# Altium schematic sheet clock_led_switches.SchDoc: Power Switches
size 290 x 209 mm; Author: chs; Revision: 1
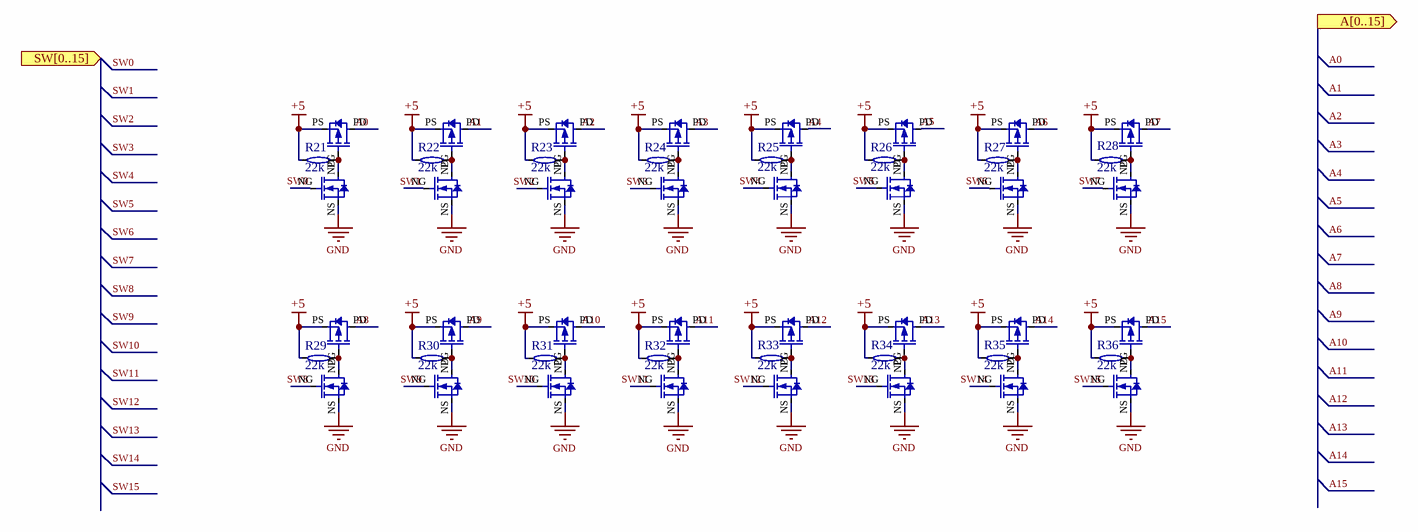
[diagram p0: clock_led_switches.SchDoc]

## Parts
Q1  PJSEMI_PJM05C20DFA  [DFN-6]  (value not drawn)  (parts A,B of 2)
Q2  PJSEMI_PJM05C20DFA  [DFN-6]  (value not drawn)  (parts A,B of 2)
Q3  PJSEMI_PJM05C20DFA  [DFN-6]  (value not drawn)  (parts A,B of 2)
Q4  PJSEMI_PJM05C20DFA  [DFN-6]  (value not drawn)  (parts A,B of 2)
Q5  PJSEMI_PJM05C20DFA  [DFN-6]  (value not drawn)  (parts A,B of 2)
Q6  PJSEMI_PJM05C20DFA  [DFN-6]  (value not drawn)  (parts A,B of 2)
Q7  PJSEMI_PJM05C20DFA  [DFN-6]  (value not drawn)  (parts A,B of 2)
Q8  PJSEMI_PJM05C20DFA  [DFN-6]  (value not drawn)  (parts A,B of 2)
Q9  PJSEMI_PJM05C20DFA  [DFN-6]  (value not drawn)  (parts A,B of 2)
Q10  PJSEMI_PJM05C20DFA  [DFN-6]  (value not drawn)  (parts A,B of 2)
Q11  PJSEMI_PJM05C20DFA  [DFN-6]  (value not drawn)  (parts A,B of 2)
Q12  PJSEMI_PJM05C20DFA  [DFN-6]  (value not drawn)  (parts A,B of 2)
Q13  PJSEMI_PJM05C20DFA  [DFN-6]  (value not drawn)  (parts A,B of 2)
Q14  PJSEMI_PJM05C20DFA  [DFN-6]  (value not drawn)  (parts A,B of 2)
Q15  PJSEMI_PJM05C20DFA  [DFN-6]  (value not drawn)  (parts A,B of 2)
Q16  PJSEMI_PJM05C20DFA  [DFN-6]  (value not drawn)  (parts A,B of 2)
R21  22k  [RES 0402_1005 RF]
R22  22k  [RES 0402_1005 RF]
R23  22k  [RES 0402_1005 RF]
R24  22k  [RES 0402_1005 RF]
R25  22k  [RES 0402_1005 RF]
R26  22k  [RES 0402_1005 RF]
R27  22k  [RES 0402_1005 RF]
R28  22k  [RES 0402_1005 RF]
R29  22k  [RES 0402_1005 RF]
R30  22k  [RES 0402_1005 RF]
R31  22k  [RES 0402_1005 RF]
R32  22k  [RES 0402_1005 RF]
R33  22k  [RES 0402_1005 RF]
R34  22k  [RES 0402_1005 RF]
R35  22k  [RES 0402_1005 RF]
R36  22k  [RES 0402_1005 RF]

## Ports
A[0..15] (out), SW[0..15] (in)

## Nets
+5: Q1.PS Q2.PS Q3.PS Q4.PS Q5.PS Q6.PS Q7.PS Q8.PS Q9.PS Q10.PS Q11.PS Q12.PS Q13.PS Q14.PS Q15.PS Q16.PS R21.1 R22.1 R23.1 R24.1 R25.1 R26.1 R27.1 R28.1 R29.1 R30.1 R31.1 R32.1 R33.1 R34.1 R35.1 R36.1
GND: Q1.NS Q2.NS Q3.NS Q4.NS Q5.NS Q6.NS Q7.NS Q8.NS Q9.NS Q10.NS Q11.NS Q12.NS Q13.NS Q14.NS Q15.NS Q16.NS
A0: Q1.PD
A1: Q2.PD
A2: Q3.PD
A3: Q4.PD
A4: Q5.PD
A5: Q6.PD
A6: Q7.PD
A7: Q8.PD
A8: Q9.PD
A9: Q10.PD
A10: Q11.PD
A11: Q12.PD
A12: Q13.PD
A13: Q14.PD
A14: Q15.PD
A15: Q16.PD
SW0: Q1.NG
SW1: Q2.NG
SW2: Q3.NG
SW3: Q4.NG
SW4: Q5.NG
SW5: Q6.NG
SW6: Q7.NG
SW7: Q8.NG
SW8: Q9.NG
SW9: Q10.NG
SW10: Q11.NG
SW11: Q12.NG
SW12: Q13.NG
SW13: Q14.NG
SW14: Q15.NG
SW15: Q16.NG
NetQ1_ND: Q1.ND Q1.PG R21.2
NetQ2_ND: Q2.ND Q2.PG R22.2
NetQ3_ND: Q3.ND Q3.PG R23.2
NetQ4_ND: Q4.ND Q4.PG R24.2
NetQ5_ND: Q5.ND Q5.PG R25.2
NetQ6_ND: Q6.ND Q6.PG R26.2
NetQ7_ND: Q7.ND Q7.PG R27.2
NetQ8_ND: Q8.ND Q8.PG R28.2
NetQ9_ND: Q9.ND Q9.PG R29.2
NetQ10_ND: Q10.ND Q10.PG R30.2
NetQ11_ND: Q11.ND Q11.PG R31.2
NetQ12_ND: Q12.ND Q12.PG R32.2
NetQ13_ND: Q13.ND Q13.PG R33.2
NetQ14_ND: Q14.ND Q14.PG R34.2
NetQ15_ND: Q15.ND Q15.PG R35.2
NetQ16_ND: Q16.ND Q16.PG R36.2

## Library data of the parts
Q1-Q16 = PJSEMI_PJM05C20DFA: Dual N/P Mofset; JLCPCB: C22470331
R21-R36 = RES_0402_22k: Chip Resistor; Value: 22k; JLCPCB: C2906913